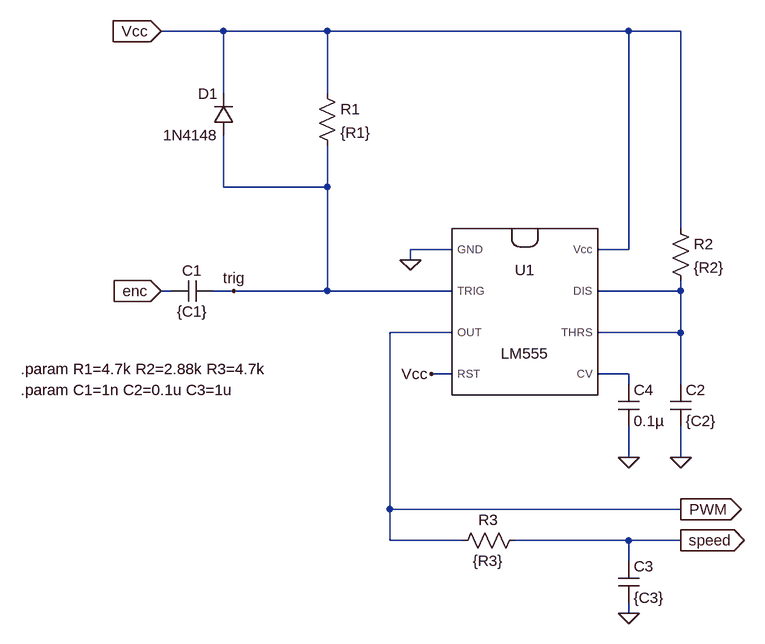
[diagram p0: schematic Speed_Sensor.asc]
Speed_Sensor.asc, the LTspice schematic file:
Version 4
SHEET 1 1416 936
WIRE 560 0 464 0
WIRE 720 0 560 0
WIRE 1184 0 720 0
WIRE 1264 0 1184 0
WIRE 560 96 560 0
WIRE 720 96 720 0
WIRE 560 240 560 160
WIRE 720 240 720 176
WIRE 720 240 560 240
WIRE 1264 304 1264 0
WIRE 912 336 848 336
WIRE 1184 336 1184 0
WIRE 1184 336 1136 336
WIRE 848 352 848 336
WIRE 480 400 464 400
WIRE 576 400 544 400
WIRE 720 400 720 240
WIRE 720 400 576 400
WIRE 912 400 720 400
WIRE 1264 400 1264 384
WIRE 1264 400 1136 400
WIRE 912 464 816 464
WIRE 1264 464 1264 400
WIRE 1264 464 1136 464
WIRE 912 528 880 528
WIRE 1184 528 1136 528
WIRE 1184 544 1184 528
WIRE 1264 544 1264 464
WIRE 1184 656 1184 608
WIRE 1264 656 1264 608
WIRE 816 736 816 464
WIRE 1264 736 816 736
WIRE 816 784 816 736
WIRE 928 784 816 784
WIRE 1184 784 1008 784
WIRE 1264 784 1184 784
WIRE 1184 816 1184 784
WIRE 1184 896 1184 880
FLAG 848 352 0
FLAG 880 528 Vcc
FLAG 576 400 trig
FLAG 1184 896 0
FLAG 1184 656 0
FLAG 1264 656 0
FLAG 1264 736 PWM
IOPIN 1264 736 Out
FLAG 1264 784 speed
IOPIN 1264 784 Out
FLAG 464 0 Vcc
IOPIN 464 0 In
FLAG 464 400 enc
IOPIN 464 400 In
SYMBOL cap 544 384 R90
WINDOW 0 0 32 VBottom 2
WINDOW 3 32 32 VTop 2
SYMATTR InstName C1
SYMATTR Value {C1}
SYMBOL res 704 80 R0
SYMATTR InstName R1
SYMATTR Value {R1}
SYMBOL diode 576 160 R180
WINDOW 0 24 64 Left 2
WINDOW 3 24 0 Left 2
SYMATTR InstName D1
SYMATTR Value 1N4148
SYMBOL LM555 1024 432 R0
SYMATTR InstName U1
SYMBOL res 1248 288 R0
SYMATTR InstName R2
SYMATTR Value {R2}
SYMBOL cap 1248 544 R0
SYMATTR InstName C2
SYMATTR Value {C2}
SYMBOL res 1024 768 R90
WINDOW 0 0 56 VBottom 2
WINDOW 3 32 56 VTop 2
SYMATTR InstName R3
SYMATTR Value {R3}
SYMBOL cap 1168 816 R0
SYMATTR InstName C3
SYMATTR Value {C3}
SYMBOL cap 1168 544 R0
SYMATTR InstName C4
SYMATTR Value 0.1µ
TEXT 248 520 Left 2 !.param R1=4.7k R2=2.88k R3=4.7k
TEXT 248 552 Left 2 !.param C1=1n C2=0.1u C3=1u

The netlist it stands for:
* Speed_Sensor.asc
C1 trig enc {C1}
R1 Vcc trig {R1}
D1 trig Vcc 1N4148
XU1 0 trig PWM Vcc N002 N001 N001 Vcc NE555  ; pins GND TRIG OUT RST CV THRS DIS Vcc
R2 Vcc N001 {R2}
C2 N001 0 {C2}
R3 speed PWM {R3}
C3 speed 0 {C3}
C4 N002 0 0.1µ
.model D D
.lib standard.dio
.param R1=4.7k R2=2.88k R3=4.7k
.param C1=1n C2=0.1u C3=1u
.lib NE555.sub
.backanno
.end